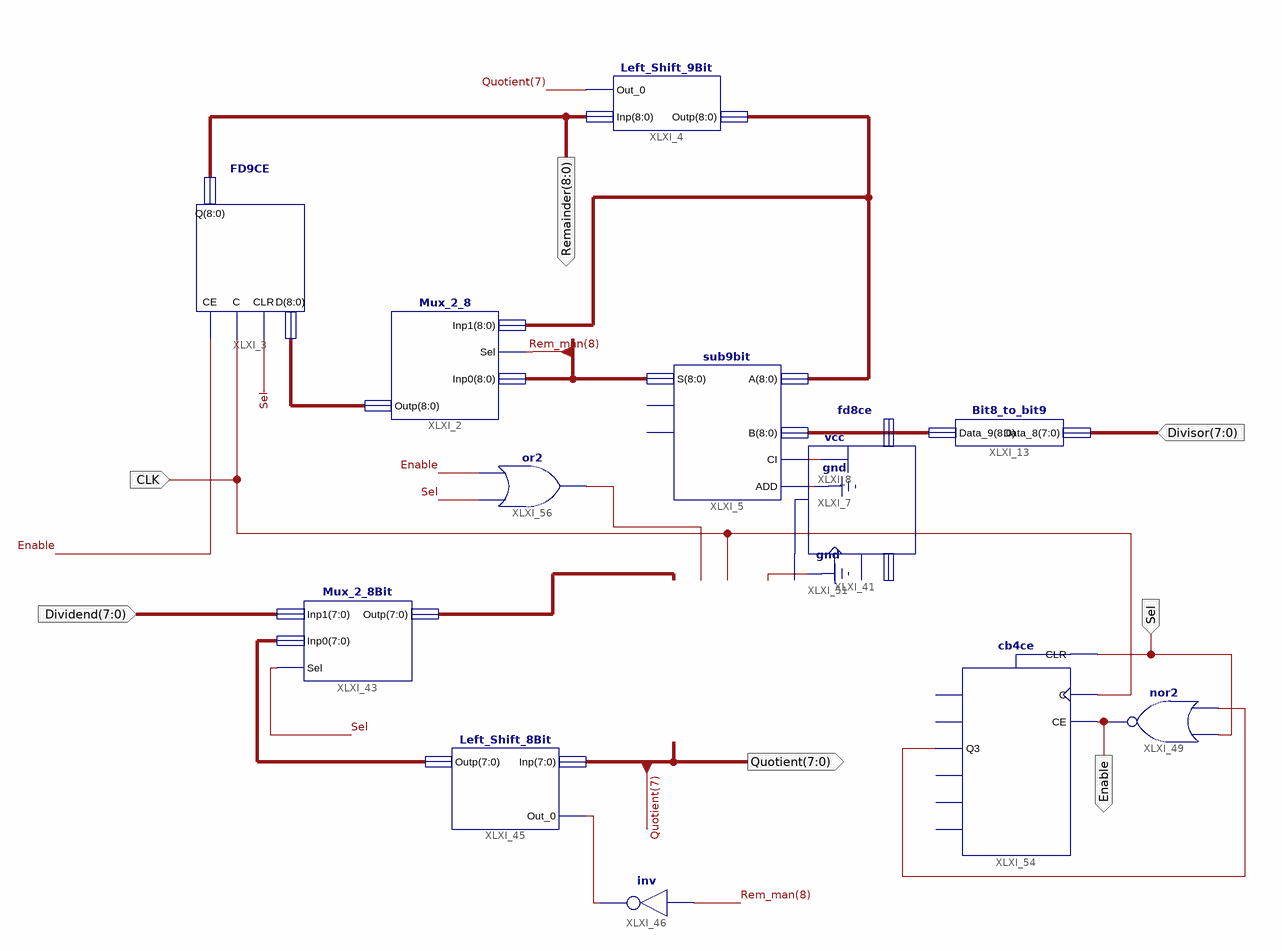
[diagram p0: schematic sheet 1]
// Xilinx ISE schematic Divide_8bit_8bit_restore.sch (spartan3e) as structural Verilog: 12 symbols, 7 ports
module Divide_8bit_8bit_restore (
  input  [7:0] Divisor,
  input  [7:0] Dividend,
  input  Sel,
  input  CLK,
  output [8:0] Remainder,
  output [7:0] Quotient,
  output Enable
);

  wire XLXN_70, XLXN_89, XLXN_94;
  wire [7:0] Quo_1, XLXN_65;
  wire [8:0] Rem_man, Remainder_new, XLXN_3, XLXN_10;

  Left_Shift_9Bit XLXI_4 (.Inp(Remainder), .Out_0(Quotient[7]), .Outp(XLXN_3));
  Mux_2_8 XLXI_2 (.Inp1(XLXN_3), .Sel(Rem_man[8]), .Inp0(Rem_man), .Outp(Remainder_new));
  sub9bit XLXI_5 (.A(XLXN_3), .B(XLXN_10), .CI(1'b1), .ADD(1'b0), .S(Rem_man));  // open: OFL, CO
  Bit8_to_bit9 XLXI_13 (.Data_8(Divisor), .Data_9(XLXN_10));
  Mux_2_8Bit XLXI_43 (.Inp1(Dividend), .Inp0(XLXN_65), .Sel(Sel), .Outp(Quo_1));
  Left_Shift_8Bit XLXI_45 (.Inp(Quotient), .Outp(XLXN_65), .Out_0(XLXN_70));
  not XLXI_46 (XLXN_70, Rem_man[8]);
  nor XLXI_49 (Enable, XLXN_89, Sel);
  FD9CE XLXI_3 (.CE(Enable), .C(CLK), .CLR(Sel), .D(Remainder_new), .Q(Remainder));
  cb4ce XLXI_54 (.C(CLK), .CE(Enable), .CLR(Sel), .Q3(XLXN_89));  // open: CEO, Q0, Q1, Q2, TC
  fd8ce XLXI_41 (.C(CLK), .CE(XLXN_94), .CLR(1'b0), .D(Quo_1), .Q(Quotient));
  or XLXI_56 (XLXN_94, Sel, Enable);
endmodule
